# Altium schematic sheet PAGE1-CONTENTS.SchDoc
size A3
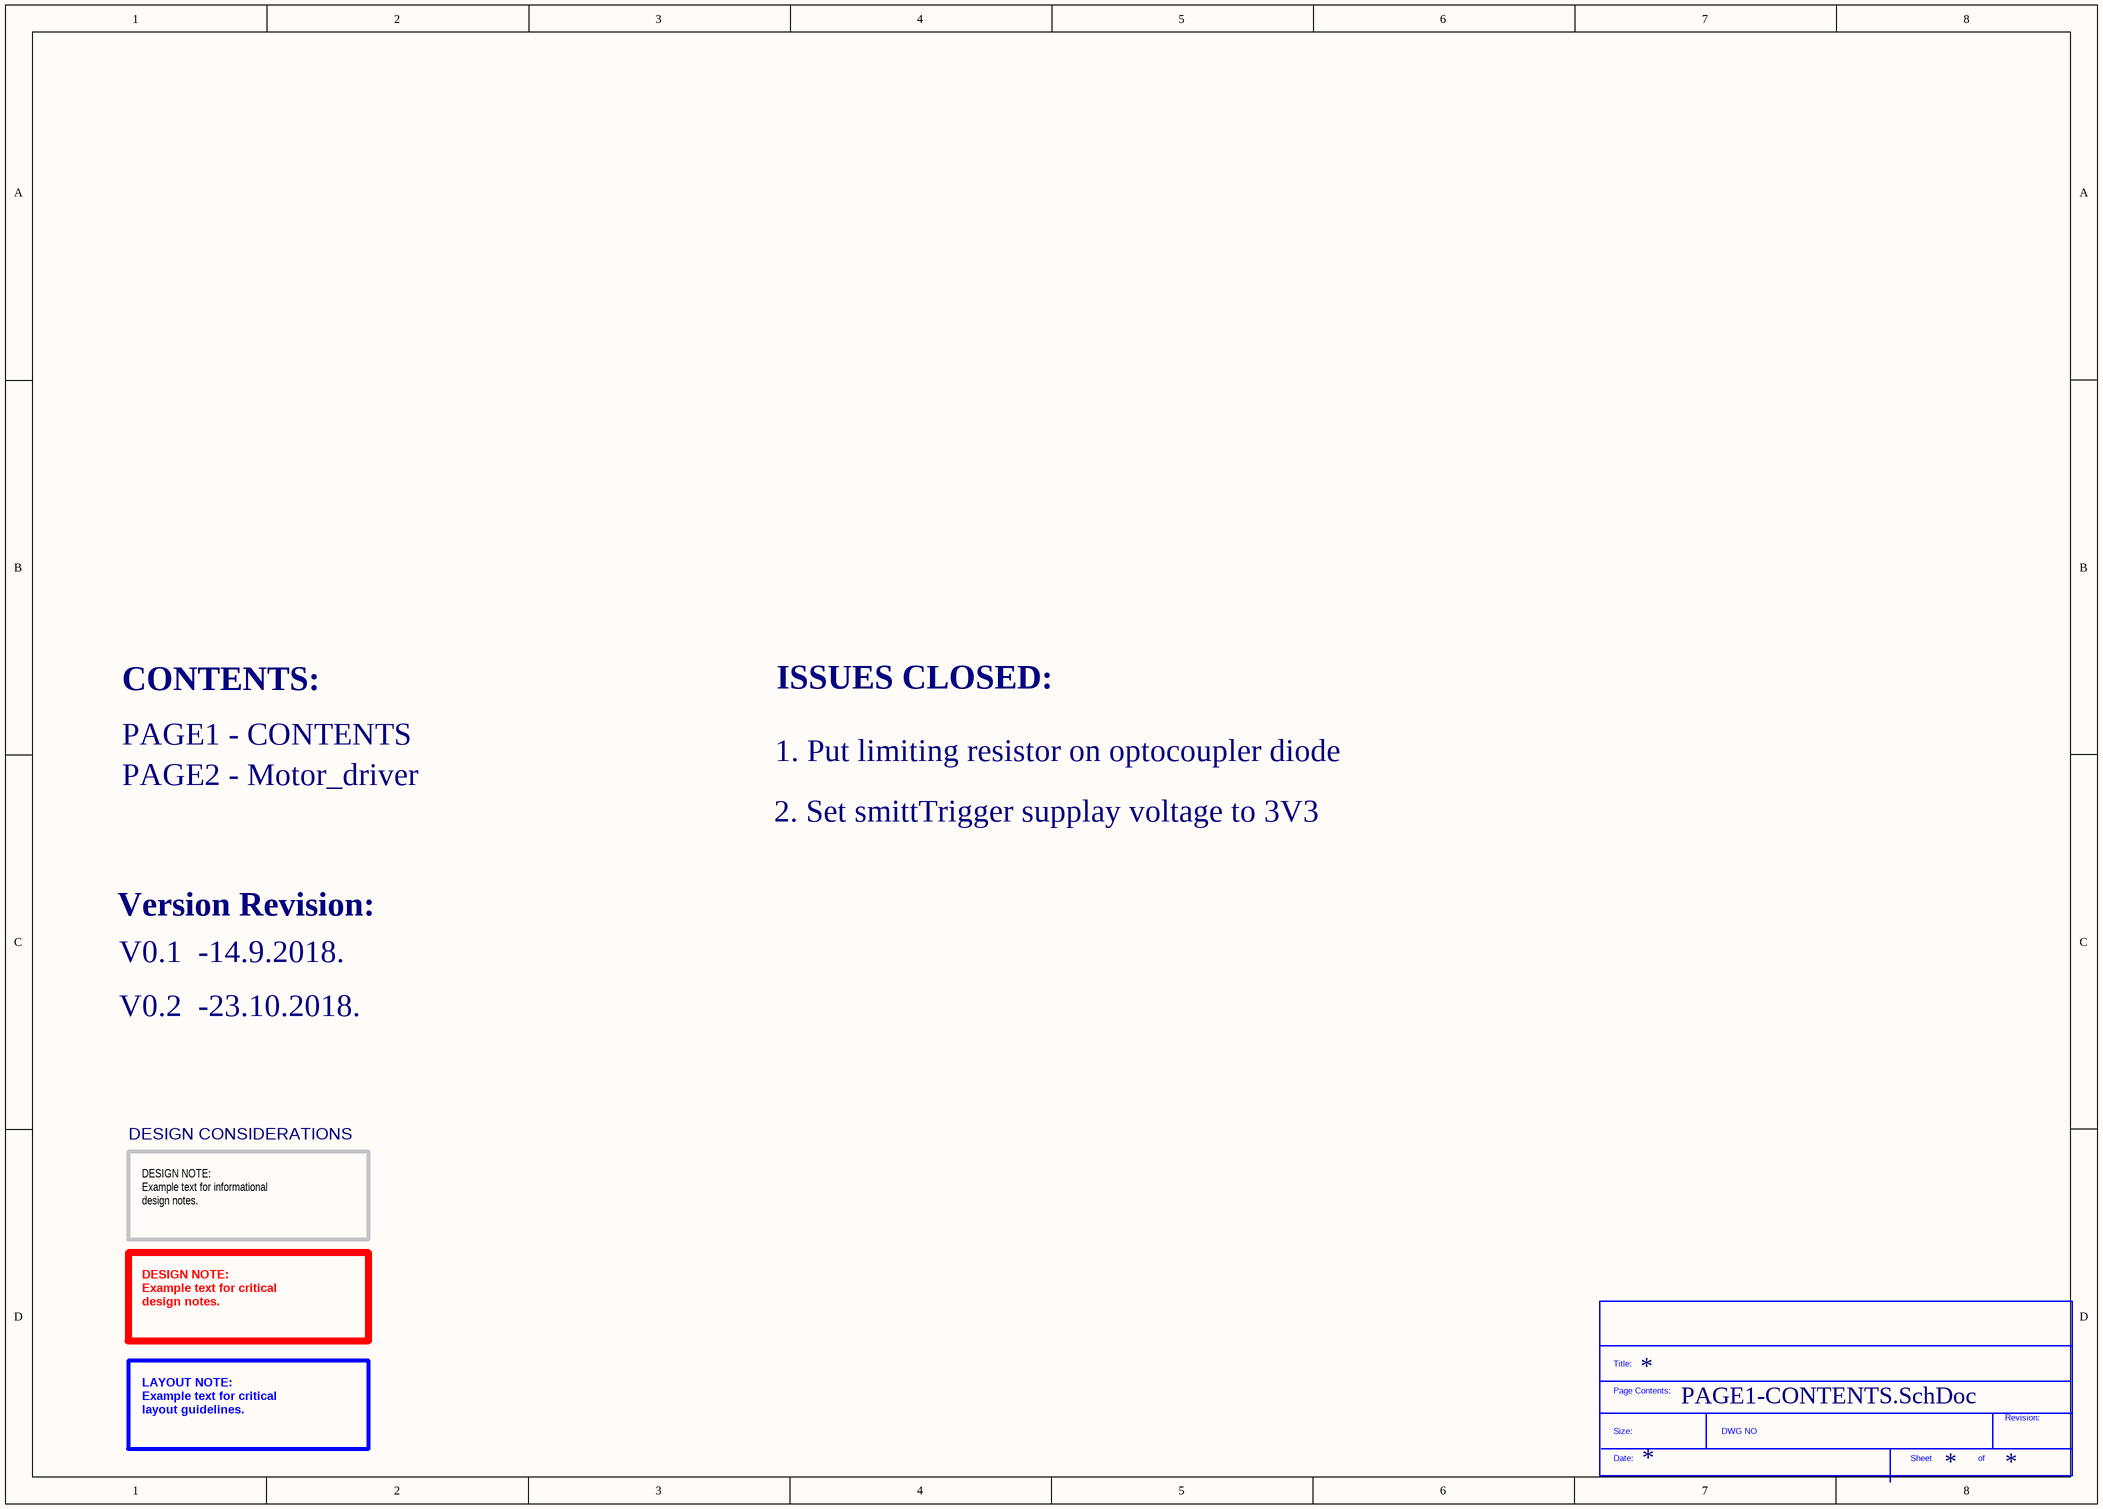
[diagram p0: PAGE1-CONTENTS.SchDoc]

## Parts
*?  SDTitleBlock  (value not drawn)  (graphical)

## Notes on the sheet
- CONTENTS:
- ISSUES CLOSED:
- PAGE1 - CONTENTS
- PAGE2 - Motor_driver
- 1. Put limiting resistor on optocoupler diode
- 2. Set smittTrigger supplay voltage to 3V3
- Version Revision:
- V0.1  -14.9.2018.
- V0.2  -23.10.2018.
- DESIGN CONSIDERATIONS
- DESIGN NOTE:
  Example text for informational
  design notes.
- DESIGN NOTE:
  Example text for critical
  design notes.
- LAYOUT NOTE:
  Example text for critical
  layout guidelines.
- (in symbol SDTitleBlock) Title:; Page Contents:; Revision:; Size:; DWG NO; Date:; Sheet; of